# EasyEDA Pro project stm32_lin_router.eprj

# Schematic Schematic1
Board Name: Board1; Create Date: 2026-08-06; Page Name: P1; Project Name: stm32_lin_router; Schematic Name: Schematic1; Update Date: 2026-08-27; Company: EasyEDA.com; Page Size: A4; Version: V1.0
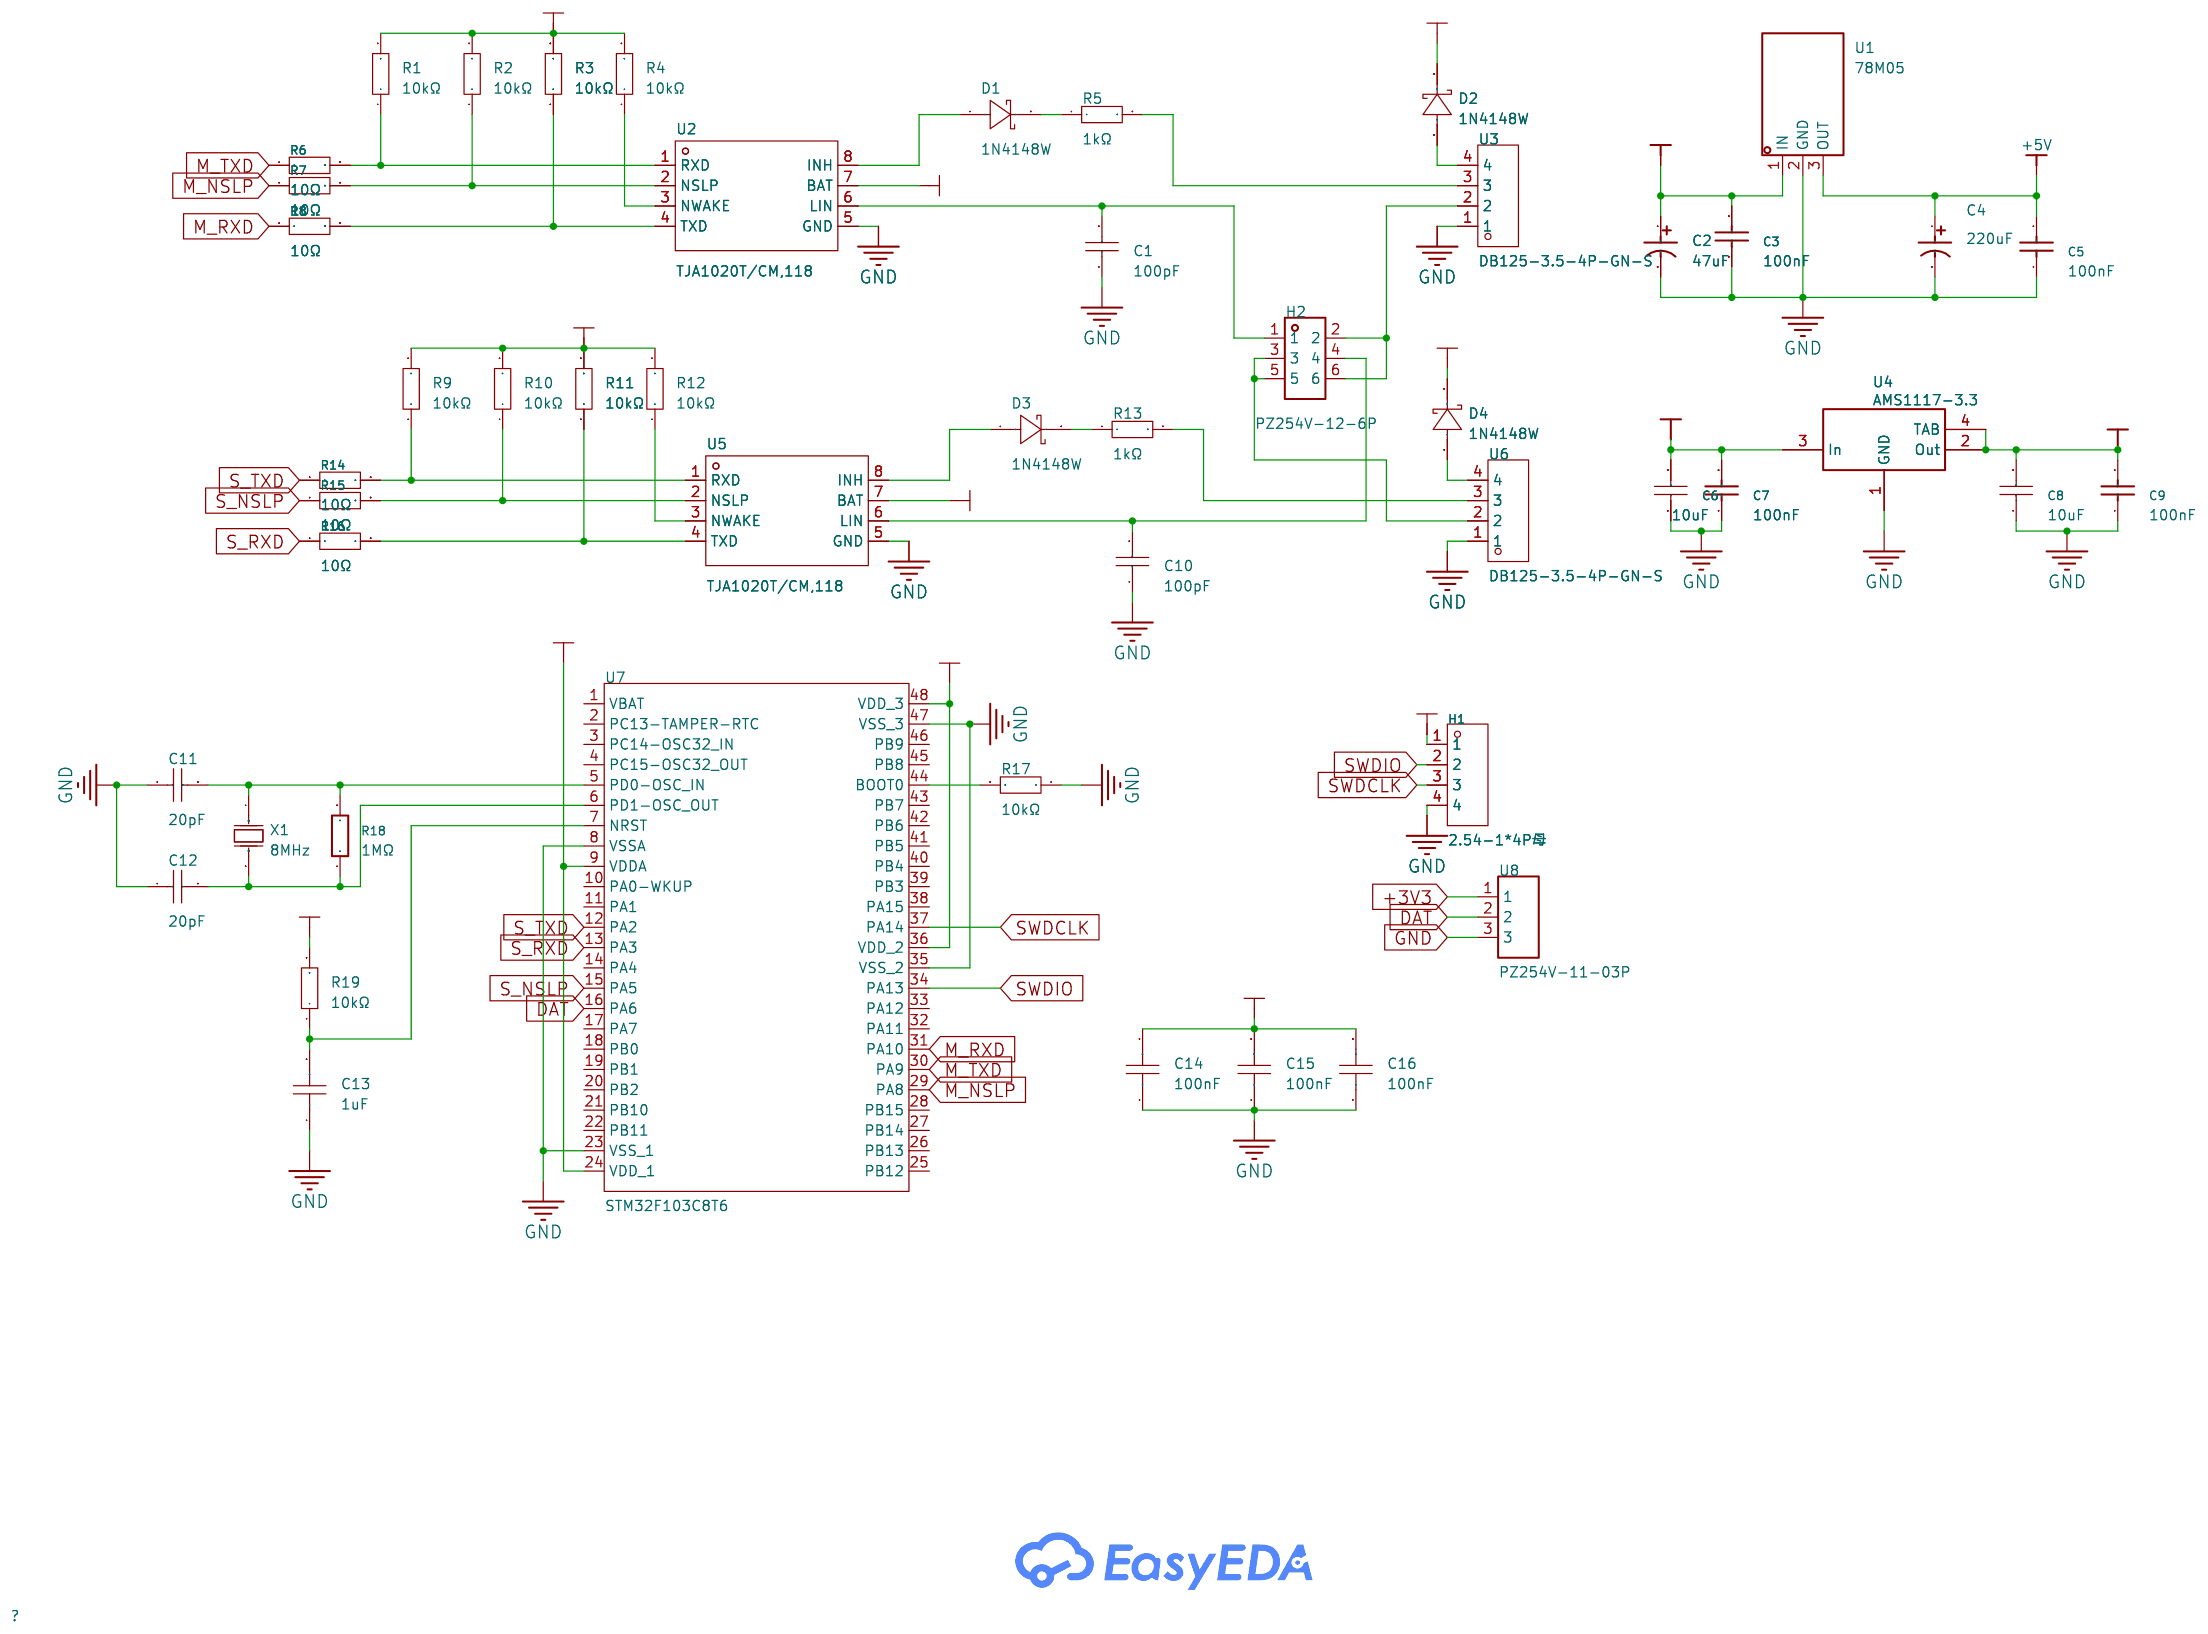
[diagram p0: schematic sheet]

## Parts
C1  100pF  [C0402]
C2  47uF  [CAP-SMD_BD6.3-L6.6-W6.6-FD]
C3  100nF  [C0402]
C4  220uF  [CAP-SMD_BD6.3-L6.6-W6.6-FD]
C5  100nF  [C0402]
C6  10uF  [C0603]
C7  100nF  [C0402]
C8  10uF  [C0603]
C9  100nF  [C0402]
C10  100pF  [C0402]
C11  20pF  [C0402]
C12  20pF  [C0402]
C13  1uF  [C0402]
C14  100nF  [C0402]
C15  100nF  [C0402]
C16  100nF  [C0402]
D1  1N4148W  [SOD-123_L2.7-W1.6-LS3.7-FD]
D2  1N4148W  [SOD-123_L2.7-W1.6-LS3.7-FD]
D3  1N4148W  [SOD-123_L2.7-W1.6-LS3.7-FD]
D4  1N4148W  [SOD-123_L2.7-W1.6-LS3.7-FD]
H1  2.54-1*4P母  [HDR-TH_4P-P2.54-V-F]
H2  PZ254V-12-6P  [HDR-TH_6P-P2.54-V-M-R2-C3-S2.54]
R1  10kΩ  [R0402]
R2  10kΩ  [R0402]
R3  10kΩ  [R0402]
R4  10kΩ  [R0402]
R5  1kΩ  [R0402]
R6  10Ω  [R0402]
R7  10Ω  [R0402]
R8  10Ω  [R0402]
R9  10kΩ  [R0402]
R10  10kΩ  [R0402]
R11  10kΩ  [R0402]
R12  10kΩ  [R0402]
R13  1kΩ  [R0402]
R14  10Ω  [R0402]
R15  10Ω  [R0402]
R16  10Ω  [R0402]
R17  10kΩ  [R0402]
R18  1MΩ  [R0402]
R19  10kΩ  [R0402]
U1  78M05  [TO-252-2_L6.6-W6.1-P4.57-LS9.9-BR-CW]
U2  TJA1020T/CM,118  [SOIC-8_L4.9-W3.9-P1.27-LS6.0-BL]
U3  DB125-3.5-4P-GN-S  [CONN-TH_DB125-3.5-4P-GN]
U4  AMS1117-3.3  [SOT-223-3_L6.5-W3.4-P2.30-LS7.0-BR]
U5  TJA1020T/CM,118  [SOIC-8_L4.9-W3.9-P1.27-LS6.0-BL]
U6  DB125-3.5-4P-GN-S  [CONN-TH_DB125-3.5-4P-GN]
U7  STM32F103C8T6  [LQFP-48_L7.0-W7.0-P0.50-LS9.0-BL]
U8  PZ254V-11-03P  [HDR-TH_3P-P2.54-V-M]
X1  8MHz  [CRYSTAL-SMD_L11.5-W4.8-LS12.7]

## Library data of the parts
C1 C10 = 0402CG101J500NT: LCSC Part Name: 100pF ±5% 50V; Supplier Part: C1546; Manufacturer: FH(风华); Supplier Footprint: 0402; JLCPCB Part Class: Basic Part; Datasheet: https://item.szlcsc.com/datasheet/0402CG101J500NT/1898.html; Supplier: LCSC; Tolerance: ±5%; Voltage Rating: 50V; Temperature Coefficient: C0G
C2 = RVT1V470M0605_C72522: Capacitance: Tolerance:±20% Tolerance:±20% Rated Voltage: Ripple Current:54mA@120Hz Equivalent Series Resistance(ESR):- φD: L: Lifetime @ Temp:2000hrs@105℃ Operating Temperature:-40℃~+105℃ Operating Temperature:-40℃~+105℃; LCSC Part Name: 47uF ±20% 35V; Supplier Part: C72522; Manufacturer: ROQANG(容强); Manufacturer Part: RVT1V470M0605; Supplier Footprint: SMD,D6.3xL5.4mm; JLCPCB Part Class: Extended Part; Datasheet: https://atta.szlcsc.com/upload/public/pdf/source/20170325/1490427950282.pdf; Supplier: LCSC; Tolerance: ±20%; Ripple Current: 54mA@120Hz; Lifetime @ Temp: 2000hrs@105℃; Operating Temperature: -40℃~+105℃
C3 C5 C7 C9 = CC0402KRX7R9BB104: Capacitance: Tolerance:±10% Tolerance:±10% Voltage Rated: Temperature Coefficient:; LCSC Part Name: 100nF ±10% 50V; Supplier Part: C131394; Manufacturer: YAGEO(国巨); Supplier Footprint: 0402; JLCPCB Part Class: Extended Part; Datasheet: https://atta.szlcsc.com/upload/public/pdf/source/20181008/C309510_22F155564471FAF6A489F7D68F34234E.pdf; Supplier: LCSC; Tolerance: ±10%
C4 = RVT1A221M0605_C72494: Capacitance: Tolerance:±20% Tolerance:±20% Rated Voltage: Ripple Current: Equivalent Series Resistance(ESR):- φD: L: Lifetime @ Temp:2000hrs@105℃ Operating Temperature:-40℃~+105℃ Operating Temperature:-40℃~+105℃; LCSC Part Name: 220uF ±20% 10V; Supplier Part: C72494; Manufacturer: ROQANG(容强); Manufacturer Part: RVT1A221M0605; Supplier Footprint: SMD,D6.3xL5.4mm; JLCPCB Part Class: Extended Part; Datasheet: https://atta.szlcsc.com/upload/public/pdf/source/20170325/1490427950282.pdf; Supplier: LCSC; Tolerance: ±20%; Lifetime @ Temp: 2000hrs@105℃; Operating Temperature: -40℃~+105℃
C6 C8 = CL10A106MO8NQNC: LCSC Part Name: 10uF ±20% 16V; Supplier Part: C92487; Manufacturer: SAMSUNG(三星); Supplier Footprint: 0603; JLCPCB Part Class: Extended Part; Datasheet: https://item.szlcsc.com/datasheet/CL10A106MO8NQNC/93680.html; Supplier: LCSC; Tolerance: ±20%; Voltage Rating: 16V; Temperature Coefficient: X5R
C11 C12 = 0402CG200J500NT: Capacitance:20pF Tolerance:±5% Tolerance:±5% Voltage Rating:50V Temperature Coefficient:C0G; LCSC Part Name: 20pF ±5% 50V; Supplier Part: C1554; Manufacturer: FH(风华); Supplier Footprint: 0402; JLCPCB Part Class: Basic Part; Datasheet: https://item.szlcsc.com/datasheet/0402CG200J500NT/1906.html; Supplier: LCSC; Tolerance: ±5%; Voltage Rating: 50V; Temperature Coefficient: C0G
C13 = CL05A105KA5NQNC: LCSC Part Name: 1uF ±10% 25V; Supplier Part: C52923; Manufacturer: SAMSUNG(三星); Supplier Footprint: 0402; JLCPCB Part Class: Basic Part; Datasheet: https://item.szlcsc.com/datasheet/CL05A105KA5NQNC/53938.html; Supplier: LCSC; Tolerance: ±10%; Voltage Rating: 25V; Temperature Coefficient: X5R
C14-C16 = CL05B104KO5NNNC: Capacitance:100nF Tolerance:±10% Tolerance:±10% Voltage Rating:16V Temperature Coefficient:X7R; LCSC Part Name: 100nF ±10% 16V; Supplier Part: C1525; Manufacturer: SAMSUNG(三星); Supplier Footprint: 0402; JLCPCB Part Class: Basic Part; Datasheet: https://item.szlcsc.com/datasheet/CL05B104KO5NNNC/1877.html; Supplier: LCSC; Tolerance: ±10%; Voltage Rating: 16V; Temperature Coefficient: X7R
D1-D4 = 1N4148W_C7420318: LCSC Part Name: 100V 150mA; Supplier Part: C7420318; Manufacturer: R+O(宏嘉诚); Supplier Footprint: SOD-123; JLCPCB Part Class: Extended Part; Datasheet: https://item.szlcsc.com/datasheet/1N4148W/8397140.html; Supplier: LCSC; Diode Configuration: Standalone; Pd - Power Dissipation: 400mW; Current - Rectified: 150mA; Voltage - DC Reverse(Vr): 100V; Voltage - Forward(Vf@If): 1.25V@150mA; Non-Repetitive Peak Forward Surge Current: 2A; Reverse Leakage Current (Ir): 1uA@75V; Reverse Recovery Time (trr): 4ns; Operating Junction Temperature Range: -55℃~+150℃
H1 = 2.54-1*4P母: LCSC Part Name: 间距:2.54mm 1x4P 直插; Supplier Part: C2718488; Manufacturer: BOOMELE(博穆精密); Supplier Footprint: 插件,P=2.54mm; JLCPCB Part Class: Extended Part; Datasheet: https://item.szlcsc.com/datasheet/2.54-1*4P%25E6%25AF%258D/2834502.html; Supplier: LCSC; Holes Structure: 1x4P; Pitch: 2.54mm; Circular Hole / Square Hole: Square Hole; Mounting Type: Through Hole; Number of Rows: 1; Number of Positions: 4P; Current Rating: 3A; Holes Direction: Top; Contact Material: Bronze; Operating Temperature: -40℃~+105℃
H2 = PZ254V-12-6P: Pin Structure:2x3P Pitch:2.54mm Row Spacing:2.54mm Circluar Pins/Square Pins:Square Pins Mounting Type:Straight Number of Rows:双排 Number of Pins:6P Current Rating (Max):- Voltage Rating (Max):- Length of Mating Pin:6mm Insulation Height:2.5mm Length of En; LCSC Part Name: 间距:2.54mm 2x3P 直插 方针; Supplier Part: C492420; Manufacturer: XFCN(兴飞); Supplier Footprint: 插件,P=2.54mm; JLCPCB Part Class: Extended Part; Datasheet: https://atta.szlcsc.com/upload/public/pdf/source/20200309/C492420_BAECB307B001054C09D200388220EAE6.pdf; Supplier: LCSC; Pin Structure: 2x3P; Pitch: 2.54mm; Row Spacing: 2.54mm; Circluar Pins/Square Pins: Square Pins; Mounting Type: Straight; Number of Rows: 双排; Number of Pins: 6P; Length of Mating Pin: 6mm; Insulation Height: 2.5mm; Length of End Connection Pin: 3mm; Operating Temperature Range: -40℃~+105℃; Color: Black
R1-R4 R9-R12 R17 R19 = 0402WGF1002TCE: LCSC Part Name: 10kΩ ±1% 62.5mW 厚膜电阻; Supplier Part: C25744; Manufacturer: UNI-ROYAL(厚声); Supplier Footprint: 0402; JLCPCB Part Class: Basic Part; Datasheet: https://item.szlcsc.com/datasheet/0402WGF1002TCE/26487.html; Supplier: LCSC; Type: Thick Film Resistor; Tolerance: ±1%; Power(Watts): 62.5mW; Voltage-Supply(Max): 50V; Temperature Coefficient: ±100ppm/℃; Operating Temperature: -55℃~+155℃
R5 R13 = 0402WGF1001TCE: LCSC Part Name: 1kΩ ±1% 62.5mW 厚膜电阻; Supplier Part: C11702; Manufacturer: UNI-ROYAL(厚声); Supplier Footprint: 0402; JLCPCB Part Class: Basic Part; Datasheet: https://item.szlcsc.com/datasheet/0402WGF1001TCE/12256.html; Supplier: LCSC; Type: Thick Film Resistor; Tolerance: ±1%; Power(Watts): 62.5mW; Voltage-Supply(Max): 50V; Temperature Coefficient: ±100ppm/℃; Operating Temperature: -55℃~+155℃
R6-R8 R14-R16 = 0402WGF100JTCE: LCSC Part Name: 10Ω ±1% 62.5mW 厚膜电阻; Supplier Part: C25077; Manufacturer: UNI-ROYAL(厚声); Supplier Footprint: 0402; JLCPCB Part Class: Basic Part; Datasheet: https://item.szlcsc.com/datasheet/0402WGF100JTCE/25820.html; Supplier: LCSC; Type: Thick Film Resistor; Tolerance: ±1%; Power(Watts): 62.5mW; Voltage-Supply(Max): 50V; Temperature Coefficient: ±200ppm/℃; Operating Temperature: -55℃~+155℃
R18 = 0402WGF1004TCE: Type:Thick Film Resistor Resistance:1MΩ Tolerance:±1% Tolerance:±1% Power(Watts):62.5mW Voltage-Supply(Max):50V Temperature Coefficient:±100ppm/℃ Temperature Coefficient:±100ppm/℃ Operating Temperature:-55℃~+155℃ Operating Temperature:-55℃~+155℃; LCSC Part Name: 1MΩ ±1% 62.5mW 厚膜电阻; Supplier Part: C26083; Manufacturer: UNI-ROYAL(厚声); Supplier Footprint: 0402; JLCPCB Part Class: Basic Part; Datasheet: https://item.szlcsc.com/datasheet/0402WGF1004TCE/26826.html; Supplier: LCSC; Type: Thick Film Resistor; Tolerance: ±1%; Power(Watts): 62.5mW; Voltage-Supply(Max): 50V; Temperature Coefficient: ±100ppm/℃; Operating Temperature: -55℃~+155℃
U1 = 78M05_C347278: Output Type:Fixed Maximum Input Voltage:35V Output Voltage:5V Output Voltage:5V Output Current:1A Power Supply Rejection Ratio (PSRR):80dB@(120Hz) Dropout Voltage:2V@(500mA) standby current:6mA Feature:Short-Circuit  Protection；Thermal Protection(TSD) Ope; LCSC Part Name: 输入35V 输出5V; Supplier Part: C347278; Manufacturer: UMW(友台半导体); Supplier Footprint: TO-252-2; JLCPCB Part Class: Extended Part; Datasheet: https://atta.szlcsc.com/upload/public/pdf/source/20240827/0E07D62EB5B1694607256ADF81712489.pdf; Supplier: LCSC; Output Type: Fixed; Maximum Input Voltage: 35V; Output Voltage: 5V; Output Current: 1A; Power Supply Rejection Ratio (PSRR): 80dB@(120Hz); Dropout Voltage: 2V@(500mA); standby current: 6mA; Feature: Short-Circuit  Protection；Thermal Protection(TSD); Operating Temperature: -20℃~+85℃; Output Polarity: Positive electrode; Number of Outputs: 1
U2 U5 = TJA1020T/CM,118: LCSC Part Name: LIN收发器; Supplier Part: C6950; Manufacturer: NXP(恩智浦); Supplier Footprint: SOIC-8; JLCPCB Part Class: Extended Part; Datasheet: https://www.nxp.com/docs/en/data-sheet/TJA1020.pdf; Supplier: LCSC; Type: Transceiver; Number of Drivers: 1; Number of Receivers: 1; Voltage - Supply: 5V~27V; Current - Supply: 8mA; Quiescent Supply Current: 3uA; ESD Protect: ±4kV; Features: Bus fault protection；Local wake-up；Slope control；TXD timeout protection；Bus wake-up；Low-power mode；Thermal shutdown protection
U3 U6 = DB125-3.5-4P-GN-S: LCSC Part Name: 1x4P 3.5mm 直插 排数:1 每排P数:4; Supplier Part: C2757925; Manufacturer: DORABO(地博电气); Supplier Footprint: 插件,P=3.5mm; JLCPCB Part Class: Extended Part; Datasheet: https://item.szlcsc.com/datasheet/DB125-3.5-4P-GN-S/2874766.html; Supplier: LCSC; Number of Positions or Pins: 1x4P; Pitch: 3.5mm; Color: Green; Mounting Type: Through Hole; Number of Pins: 4P; Number of Rows: 1; Number of PINs Per Row: 4; Screw Specification: M2; Current Rating: 10A; Voltage Rating (Max): 300V; Wire Gauge - AWG: 16~28; Wire Gauge - mm2: 1; Operating Temperature: -40℃~+105℃; Height Above Board: 8.6mm
U4 = AMS1117-3.3: Supplier Part: C6186; Supplier: LCSC; Manufacturer: AMS; image: //image.lceda.cn/szlcsc/C6186.jpg; sourceId: dwIGgezVh; timeStamp: 1476261164; LCSC Assembly: Yes; spicePre: U
U7 = STM32F103C8T6: LCSC Part Name: 主流增强型ARM Cortex-M3 MCU，具有64 KB Flash、72 MHz CPU、电机控制、USB和CAN; Supplier Part: C8734; Manufacturer: ST(意法半导体); Supplier Footprint: LQFP-48(7x7); JLCPCB Part Class: Extended Part; Datasheet: https://item.szlcsc.com/datasheet/STM32F103C8T6/9243.html; Supplier: LCSC; CPU Core: ARM Cortex-M3; CPU Maximum Speed: 72MHz; Core Size: 32 Bit; Program Storage Size: 64KB; Program Memory Type: FLASH; RAM Size: 20KB; Number of I/O: 37; ADC (Bit): 12bit; Oscillator Type: Built-in; Voltage - Supply: 2V~3.6V; Operating Temperature: -40℃~+85℃
U8 = PZ254V-11-03P: Pin Structure:1x3P Pitch:2.54mm Row Spacing:- Circluar Pins/Square Pins:Policy Mounting Type:Straight Number of Rows:Single Row Number of Pins:3P Current Rating:3A Voltage Rating (Max):250V Length of Mating Pin:6mm Insulation Height:2.5mm Length of End Co; LCSC Part Name: 1x3P 间距:2.54mm 方针 直插; Supplier Part: C2937625; Manufacturer: XFCN(兴飞); Supplier Footprint: 插件,P=2.54mm; JLCPCB Part Class: Extended Part; Datasheet: https://atta.szlcsc.com/upload/public/pdf/source/20200309/C492402_8335C3D49C4E4C618838D59BB1D024C1.pdf; Supplier: LCSC; Pin Structure: 1x3P; Pitch: 2.54mm; Circluar Pins/Square Pins: Policy; Mounting Type: Straight; Number of Rows: Single Row; Number of Pins: 3P; Current Rating: 3A; Voltage Rating (Max): 250V; Length of Mating Pin: 6mm; Insulation Height: 2.5mm; Length of End Connection Pin: 3mm; Operating Temperature: -40℃~+105℃; Color: Black
X1 = X49SM8MSD2SC: Type:Crystal Oscillator Frequency:8MHz Normal temperature Frequency Tolerance:±20ppm Normal temperature Frequency Tolerance:±20ppm Load Capacitance:20pF Frequency Stability:±30ppm Frequency Stability:±30ppm Operating Temperature:-20℃~+70℃ Operating Temper; LCSC Part Name: HC-49SMD 8MHZ 20PF ±20PPM -20~70℃（±30PPM）; Supplier Part: C12674; Manufacturer: YXC(扬兴晶振); Supplier Footprint: HC-49S-SMD; JLCPCB Part Class: Basic Part; Datasheet: https://item.szlcsc.com/datasheet/X49SM8MSD2SC/13310.html; Supplier: LCSC; Type: Crystal Oscillator; Normal temperature Frequency Tolerance: ±20ppm; Load Capacitance: 20pF; Frequency Stability: ±30ppm; Operating Temperature: -20℃~+70℃

## Nets
+3V3: C8.2 C9.2 C14.2 C15.2 C16.2 H1.1 R1.2 R2.2 R3.2 R4.2 R9.2 R10.2 R11.2 R12.2 R19.2 U4.2(Out) U4.4(TAB) U7.9(VDDA) U7.24(VDD_1) U7.36(VDD_2) U7.48(VDD_3) U8.1
+5V: C4.1 C5.2 C6.2 C7.2 U1.3(OUT) U4.3(In)
+12V: C2.1 C3.2 D2.2(K) U1.1(IN) U2.7(BAT)
+12V_S: D4.2(K) U5.7(BAT)
GND: C1.1 C2.2 C3.1 C4.2 C5.1 C6.1 C7.1 C8.1 C9.1 C10.1 C11.1 C12.1 C13.1 C14.1 C15.1 C16.1 H1.4 R17.1 U1.2(GND) U2.5(GND) U3.1 U4.1(GND) U5.5(GND) U6.1 U7.8(VSSA) U7.23(VSS_1) U7.35(VSS_2) U7.47(VSS_3) U8.3
DAT: U7.16(PA6) U8.2
M_NSLP: R7.1 U7.29(PA8)
M_RXD: R8.1 U7.31(PA10)
M_TXD: R6.1 U7.30(PA9)
S_NSLP: R15.1 U7.15(PA5)
S_RXD: R16.1 U7.13(PA3)
S_TXD: R14.1 U7.12(PA2)
SWDCLK: H1.3 U7.37(PA14)
SWDIO: H1.2 U7.34(PA13)
$1N1166: R4.1 U2.3(NWAKE)
$1N1222: R1.1 R6.2 U2.1(RXD)
$1N1227: R3.1 R8.2 U2.4(TXD)
$1N1230: R2.1 R7.2 U2.2(NSLP)
$1N1781: D1.1(A) U2.8(INH)
$1N1787: D1.2(K) R5.1
$1N2135: D2.1(A) U3.4
$1N2141: R5.2 U3.3
$1N2164: C1.2 H2.1 U2.6(LIN)
$1N3687: R11.1 R16.2 U5.4(TXD)
$1N3688: R12.1 U5.3(NWAKE)
$1N3690: R9.1 R14.2 U5.1(RXD)
$1N3691: R10.1 R15.2 U5.2(NSLP)
$1N3697: D3.1(A) U5.8(INH)
$1N3699: R13.2 U6.3
$1N3700: D4.1(A) U6.4
$1N3701: D3.2(K) R13.1
$1N5497: R17.2 U7.44(BOOT0)
$1N5531: C11.2 R18.2 U7.5(PD0-OSC_IN) X1.1(OSC1)
$1N5532: C12.2 R18.1 U7.6(PD1-OSC_OUT) X1.2(OSC2)
$1N5663: C13.2 R19.1 U7.7(NRST)
$1N6885: H2.2 H2.6 U3.2
$1N6918: H2.3 H2.5 U6.2
$1N6930: C10.2 H2.4 U5.6(LIN)

Not connected (* = marked no-connect by the designer): U7 1(VBAT) 2(PC13-TAMPER-RTC) 3(PC14-OSC32_IN) 4(PC15-OSC32_OUT) 10(PA0-WKUP) 11(PA1) 14(PA4) 17(PA7) 18(PB0) 19(PB1) 20(PB2) 21(PB10) 22(PB11) 25(PB12) 26(PB13) 27(PB14) 28(PB15) 32(PA11) 33(PA12) 38(PA15) 39(PB3) 40(PB4) 41(PB5) 42(PB6) 43(PB7) 45(PB8) 46(PB9)

# Board PCB1
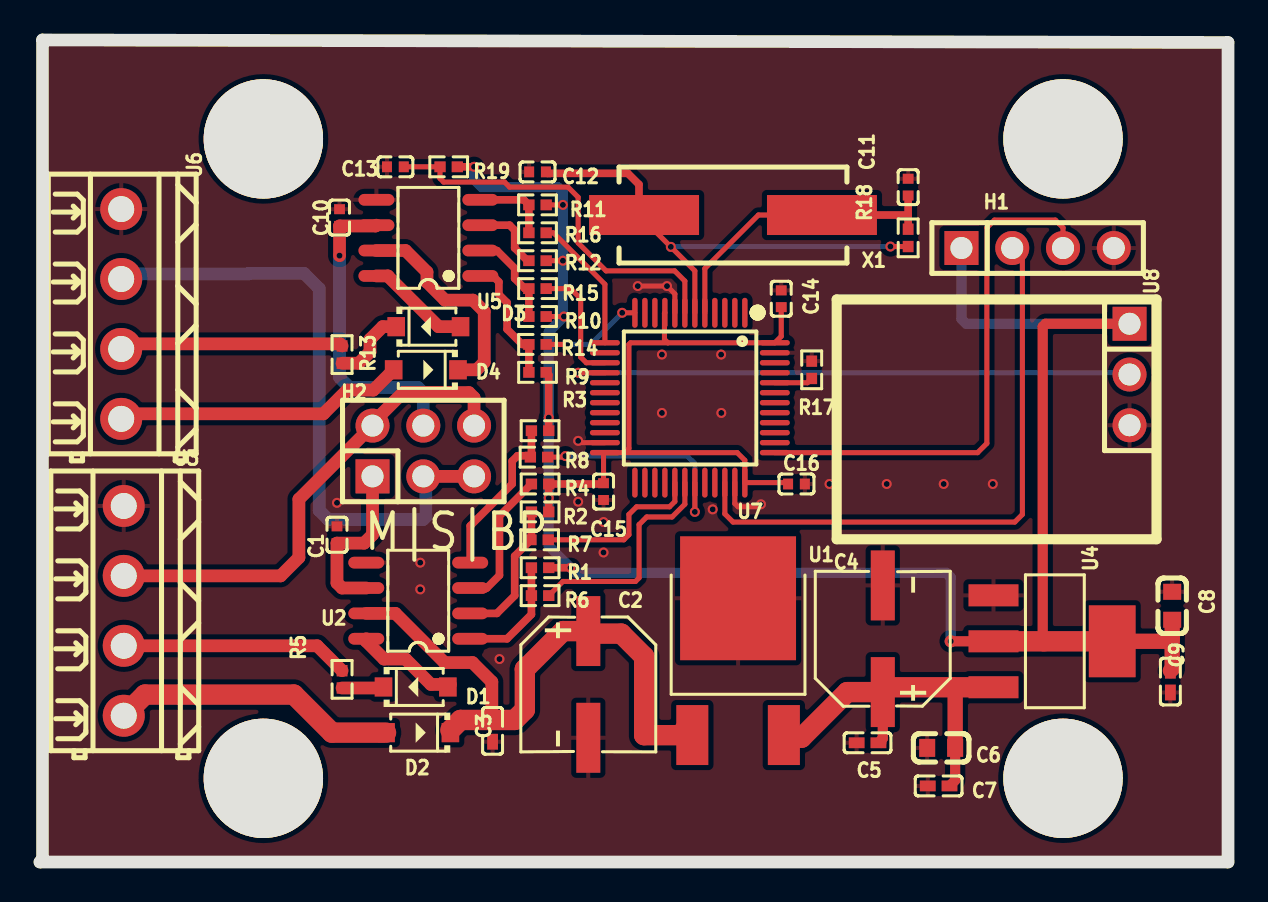
[diagram p1: board, top side]
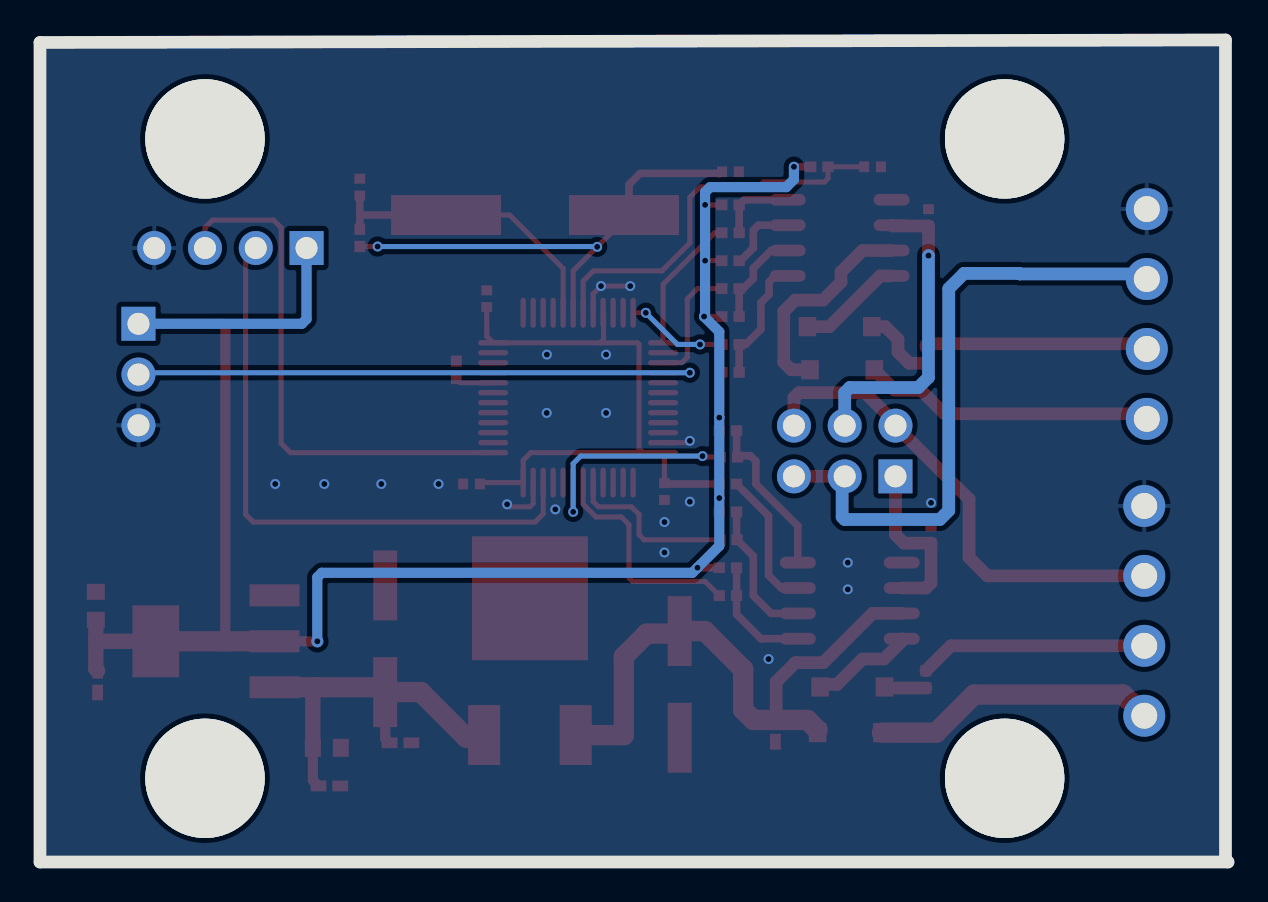
[diagram p2: board, bottom side, seen from below]

Outline 59.44 x 41.15 mm; copper layers: Top Layer, Bottom Layer. Coordinates in mm from the lower left corner of the outline.
Outline path: 0,0 59.44,0 59.44,41.02 0.13,41.15 0.13,0.13 0,0
Stack: Top Layer 0.035mm / Dielectric1 1.51mm FR4 er 4.5 / Bottom Layer 0.035mm

## Design rules (mm)
template: Custom Config
spacing copperThickness1oz (default): track to track 0.102, other pairs 0.152 to 0.3
spacing copperThickness2oz: track to track 0.203, other pairs 0.152 to 0.3
track width copperThickness1oz (default): min 0.127, default 0.254, max 2.54
track width copperThickness2oz: min 0.203, default 0.254, max 2.54
differential pair differentialPair (default): width min 0.127, default 0.254, max 2.54; gap min 0.152, default 0.152
via viaSize (default): diameter min 0.5, default 0.5, max 10; hole min 0.3, default 0.3, max 6.3

## Placement (name value [footprint] x y rotation side)
C1  100pF  [C0402]  14.86 16.38 270 top
C2  47uF  [CAP-SMD_BD6.3-L6.6-W6.6-FD]  27.43 8.89 270 top
C3  100nF  [C0402#2]  22.64 6.57 90 top
C4  220uF  [CAP-SMD_BD6.3-L6.6-W6.6-FD]  42.16 11.18 90 top
C5  100nF  [C0402#2]  41.4 5.97 0 top
C6  10uF  [C0603]  45.09 5.72 0 top
C7  100nF  [C0402#2]  44.96 3.81 0 top
C8  10uF  [C0603]  56.64 12.83 270 top
C9  100nF  [C0402#2]  56.55 9.03 90 top
C10  100pF  [C0402]  14.99 32.26 270 top
C11  20pF  [C0402]  43.43 33.78 270 top
C12  20pF  [C0402]  24.89 34.54 0 top
C13  1uF  [C0402]  17.78 34.8 0 top
C14  100nF  [C0402]  37.08 28.19 270 top
C15  100nF  [C0402]  28.19 18.54 90 top
C16  100nF  [C0402]  37.85 18.92 180 top
D1  1N4148W  [SOD-123_L2.7-W1.6-LS3.7-FD]  18.8 8.76 180 top
D2  1N4148W  [SOD-123_L2.7-W1.6-LS3.7-FD]  18.92 6.48 0 top
D3  1N4148W  [SOD-123_L2.7-W1.6-LS3.7-FD]  19.43 26.8 180 top
D4  1N4148W  [SOD-123_L2.7-W1.6-LS3.7-FD]  19.3 24.64 0 top
H1  2.54-1*4P母  [HDR-TH_4P-P2.54-V-F]  49.91 30.73 0 top
H2  PZ254V-12-6P  [HDR-TH_6P-P2.54-V-M-R2-C3-S2.54]  19.18 20.57 0 top
NOREF  -  [Pad_e100]  11.18 4.19 0 top
NOREF#2  -  [Pad_e97]  51.18 36.2 0 top
NOREF#3  -  [Pad_e92]  11.18 36.2 0 top
NOREF#4  -  [Pad_e101]  51.18 4.19 0 top
R1  10kΩ  [R0402]  25.02 14.73 0 top
R2  10kΩ  [R0402]  25.02 17.53 0 top
R3  10kΩ  [R0402]  25.02 21.59 0 top
R4  10kΩ  [R0402]  25.02 18.92 0 top
R5  1kΩ  [R0402]  15.11 9.14 90 top
R6  10Ω  [R0402]  25.02 13.34 180 top
R7  10Ω  [R0402]  25 16.13 180 top
R8  10Ω  [R0402]  24.97 20.27 180 top
R9  10kΩ  [R0402]  24.89 24.51 0 top
R10  10kΩ  [R0402]  24.89 27.31 0 top
R11  10kΩ  [R0402]  24.89 32.89 0 top
R12  10kΩ  [R0402]  24.89 30.1 0 top
R13  1kΩ  [R0402]  15.11 25.4 90 top
R14  10Ω  [R0402]  24.89 25.91 180 top
R15  10Ω  [R0402]  24.89 28.7 180 top
R16  10Ω  [R0402]  24.89 31.5 180 top
R17  10kΩ  [R0402]  38.61 24.64 270 top
R18  1MΩ  [R0402]  43.43 31.24 90 top
R19  10kΩ  [R0402]  20.45 34.8 0 top
U1  78M05  [TO-252-2_L6.6-W6.1-P4.57-LS9.9-BR-CW]  34.93 9.78 270 top
U2  TJA1020T/CM,118  [SOIC-8_L4.9-W3.9-P1.27-LS6.0-BL]  18.92 13.08 90 top
U3  DB125-3.5-4P-GN-S  [CONN-TH_DB125-3.5-4P-GN]  4.19 12.57 270 top
U4  AMS1117-3.3  [SOT-223-3_L6.5-W3.4-P2.30-LS7.0-BR]  50.67 11.05 180 top
U5  TJA1020T/CM,118  [SOIC-8_L4.9-W3.9-P1.27-LS6.0-BL]  19.43 31.24 90 top
U6  DB125-3.5-4P-GN-S  [CONN-TH_DB125-3.5-4P-GN]  4.06 27.43 270 top
U7  STM32F103C8T6  [LQFP-48_L7.0-W7.0-P0.50-LS9.0-BL]  32.51 23.24 180 top
U8  PZ254V-11-03P  [HDR-TH_3P-P2.54-V-M]  54.51 24.4 270 top
X1  8MHz  [CRYSTAL-SMD_L11.5-W4.8-LS12.7]  34.67 32.39 180 top

## Footprints (pads in the part's own frame, mm; a bottom-side part is the same pattern mirrored in y, then rotated)
C0402
  rect 0.5x0.54 smd: 1(-0.42,0) 2(0.42,0)
C0402#2
  rect 0.79x0.54 smd: 1(-0.545,0) 2(0.545,0)
C0603
  rect 0.8x0.9 smd: 1(-0.7,0) 2(0.7,0)
CAP-SMD_BD6.3-L6.6-W6.6-FD
  rect 3.5x1.2 smd: 1(-2.67,0) 2(2.67,0)
CONN-TH_DB125-3.5-4P-GN
  round 2.1 hole 1.3: 1(-5.25,0) 2(-1.75,0) 3(1.75,0) 4(5.25,0)
CRYSTAL-SMD_L11.5-W4.8-LS12.7
  rect 5.5x2 smd: 1(-4.45,0) 2(4.45,0)
HDR-TH_3P-P2.54-V-M
  rect 1.7x1.7 hole 1.1: 1(-2.54,0)
  round 1.7 hole 1.1: 2(0,0) 3(2.54,0)
HDR-TH_4P-P2.54-V-F
  rect 1.7x1.7 hole 1.1: 1(-3.81,0)
  round 1.7 hole 1.1: 2(-1.27,0) 3(1.27,0) 4(3.81,0)
HDR-TH_6P-P2.54-V-M-R2-C3-S2.54
  rect 1.7x1.7 hole 1.1: 1(-2.54,-1.27)
  round 1.7 hole 1.1: 2(-2.54,1.27) 3(0,-1.27) 4(0,1.27) 5(2.54,-1.27) 6(2.54,1.27)
LQFP-48_L7.0-W7.0-P0.50-LS9.0-BL
  oval 0.27x1.5 smd: 1(-2.75,-4.25) 2(-2.25,-4.25) 3(-1.75,-4.25) 4(-1.25,-4.25) 5(-0.75,-4.25) 6(-0.25,-4.25) 7(0.25,-4.25) 8(0.75,-4.25) 9(1.25,-4.25) 10(1.75,-4.25) 11(2.25,-4.25) 12(2.75,-4.25) 25(2.75,4.25) 26(2.25,4.25) 27(1.75,4.25) 28(1.25,4.25) 29(0.75,4.25) 30(0.25,4.25) 31(-0.25,4.25) 32(-0.75,4.25) 33(-1.25,4.25) 34(-1.75,4.25) 35(-2.25,4.25) 36(-2.75,4.25)
  oval 1.5x0.27 smd: 13(4.25,-2.75) 14(4.25,-2.25) 15(4.25,-1.75) 16(4.25,-1.25) 17(4.25,-0.75) 18(4.25,-0.25) 19(4.25,0.25) 20(4.25,0.75) 21(4.25,1.25) 22(4.25,1.75) 23(4.25,2.25) 24(4.25,2.75) 37(-4.25,2.75) 38(-4.25,2.25) 39(-4.25,1.75) 40(-4.25,1.25) 41(-4.25,0.75) 42(-4.25,0.25) 43(-4.25,-0.25) 44(-4.25,-0.75) 45(-4.25,-1.25) 46(-4.25,-1.75) 47(-4.25,-2.25) 48(-4.25,-2.75)
Pad_e92
  round 5.969 hole 5.969: 1(0,0)
Pad_e97
  round 5.969 hole 5.969: 1(0,0)
Pad_e100
  round 5.969 hole 5.969: 1(0,0)
Pad_e101
  round 5.969 hole 5.969: 1(0,0)
R0402
  rect 0.566x0.54 smd: 1(-0.433,0) 2(0.433,0)
SOD-123_L2.7-W1.6-LS3.7-FD
  rect 0.88x0.96 smd: 1(-1.61,0) 2(1.61,0)
SOIC-8_L4.9-W3.9-P1.27-LS6.0-BL
  oval 0.588x1.8 smd: 1(-1.905,-2.6) 2(-0.635,-2.6) 3(0.635,-2.6) 4(1.905,-2.6) 5(1.905,2.6) 6(0.635,2.6) 7(-0.635,2.6) 8(-1.905,2.6)
SOT-223-3_L6.5-W3.4-P2.30-LS7.0-BR
  rect 2.5x1.1 smd: 1(2.97,-2.3) 2(2.97,0) 3(2.97,2.3)
  rect 2.34x3.6 smd: 4(-2.97,0)
TO-252-2_L6.6-W6.1-P4.57-LS9.9-BR-CW
  rect 3x1.6 smd: 1(3.424,-2.29) 3(3.424,2.29)
  rect 6.2x5.8 smd: 2(-3.424,0)

## Nets
As in the schematic.

Pads without a net: NOREF 1; NOREF#2 1; NOREF#3 1; NOREF#4 1; U7 1 2 3 4 10 11 14 17 18 19 20 21 22 25 26 27 28 32 33 38 39 40 41 42 43 45 46

## Via types
v1: diameter 0.5, hole 0.3, Top Layer to Bottom Layer, 34 vias
v2: diameter 0.61, hole 0.305, Top Layer to Bottom Layer, 2 vias

## Routing (per net, layer and track width the routed paths; a pad name or vN(x,y) marks a point on that pad's centre or on a via; arc(x,y) is an arc through that point)
+3V3: length 133.3
  Top Layer w0.254: 29.25,20.49 U7.24 28.19,20.42 C15.2 ; 29.25,20.49 34.88,20.49 35.26,20.11 U7.36 37.36,18.99 C16.2 ; 29.25,20.49 29.46,20.7 29.46,25.91 29.55,25.99 31.41,25.99 ; 31.41,25.99 31.24,26.16 31.24,27.47 U7.9 ; 31.41,25.99 U7.48 37.08,26.31 C14.2 ; R11.2 v1(26.16,32.89) ; R10.2 v1(26.21,27.31) ; R12.2 v1(26.16,30.1)
  Top Layer w0.381: C15.2 28.16,18.92 R4.2 v1(25.45,18.22) R2.2 ; v1(26.54,14.73) R1.2 ; v1(21.72,34.8) R19.2 ; R9.2 25.45,24.38 v1(25.45,22.24) R3.2
  Top Layer w0.508: U8.1 50.31,26.94 50.16,26.8 50.16,11.1 50.22,11.05 ; U4.2 v2(45.56,11.05)
  Top Layer w0.762: C9.2 56.64,9.67 56.64,11.14 ; U4.4 56.55,11.05 56.64,11.14 ; 56.64,11.14 C8.2
  Top Layer w1.016: U4.4 U4.2
  Bottom Layer w0.508: v2(45.56,11.05) 45.56,14.26 45.34,14.48 26.8,14.48 v1(26.54,14.73) 25.45,15.82 v1(25.45,18.22) v1(25.45,22.24) 25.45,26.54 v1(26.21,27.31) 26.16,27.36 v1(26.16,30.1) v1(26.16,32.89) 26.16,33.53 25.91,33.78 22.1,33.78 21.72,34.16 v1(21.72,34.8) ; U8.1 46.34,26.94 46.1,27.18 H1.1
+5V: length 20
  Top Layer w0.508: 42.09,5.96 42.09,6.11 42.16,6.19 C4.1 ; C7.2 45.78,4.09 C6.2
  Top Layer w0.762: 45.64,8.75 45.78,8.6 C6.2
  Top Layer w1.016: U4.3 42.41,8.75 C4.1 40.38,8.51 38.1,6.22 37.22,6.22 37.22,6.99
+12V: length 29.7
  Top Layer w0.635: C3.2 22.61,7.15 22.61,9.02 21.64,9.98 20.24,9.98 17.78,12.45 U2.7
  Top Layer w1.016: 20.53,6.6 21.04,7.11 C3.2 23.75,7.11 24.26,7.62 24.26,9.65 26.16,11.56 C2.1 27.56,11.43 29.08,11.43 30.23,10.29 30.23,6.35 32,6.35 32.63,6.99
+12V_S: length 11
  Top Layer w0.635: U5.7 18.29,30.61 19.36,29.53 19.36,29.03 20.26,28.13 21.66,28.13 22.22,27.56 22.22,25.02 21.85,24.64 D4.2
GND: length 6.8
  Top Layer w0.254: U7.23 27.02,20.99 v1(26.92,21.08) ; v1(29.91,28.83) v1(31.37,28.83) 31.76,28.44 U7.8 ; v1(36.07,17.91) 35.94,17.78 34.93,17.78 34.76,17.94 U7.35
  vias: v1(14.86,17.98) v1(19.02,14.99) v1(19.02,13.65) v1(22.99,10.16) v1(26.92,18.03) v1(28.19,17.02) v1(28.19,15.49) v1(31.12,25.4) v1(31.12,22.48) v1(33.66,17.65) v1(34.08,25.4) v1(34.09,22.48) v1(39.5,18.92) v1(42.36,18.92) v1(45.21,18.92) v1(47.67,18.92)
DAT: length 29
  Top Layer w0.254: U7.16 v1(26.92,24.49)
  Bottom Layer w0.254: v1(26.92,24.49) 54.42,24.49 U8.2
M_NSLP: length 8.7
  Top Layer w0.254: R7.1 29.21,16.13 29.46,16.38 29.46,17.4 29.84,17.78 31.5,17.78 31.76,18.05 U7.29
M_RXD: length 11.4
  Top Layer w0.254: U7.31 v1(32.76,17.53) ; v1(26.29,20.32) 26.24,20.27 R8.1
  Bottom Layer w0.254: v1(32.76,17.53) 32.76,19.94 32.38,20.32 v1(26.29,20.32)
M_TXD: length 11.3
  Top Layer w0.254: U7.30 32.26,17.91 31.62,17.27 30.35,17.27 29.97,16.89 29.97,14.22 29.79,14.04 26.16,14.04 R6.1
S_NSLP: length 6.2
  Top Layer w0.254: R15.1 26.54,28.7 27.05,28.19 27.05,25.27 27.33,24.99 U7.15
S_RXD: length 6.9
  Top Layer w0.254: U7.13 28.26,28.92 25.68,31.5 R16.1
S_TXD: length 5.1
  Top Layer w0.254: R14.1 v1(26.42,25.91) ; v1(29.13,27.49) U7.12
  Bottom Layer w0.254: v1(26.42,25.91) 27.54,25.91 v1(29.13,27.49)
SWDCLK: length 26.7
  Top Layer w0.254: U7.37 46.91,20.49 47.37,20.96 47.37,31.75 47.75,32.13 50.8,32.13 51.18,31.75 H1.3
SWDIO: length 30.3
  Top Layer w0.254: H1.2 49.15,30.23 49.15,17.4 48.77,17.02 34.67,17.02 34.26,17.43 U7.34
$1N1166: length 7
  Top Layer w0.381: 22.22,13.72 22.35,13.72 22.99,14.35 22.99,17.32 R4.1
  Top Layer w0.508: U2.3 22.22,13.72
$1N1222: length 5.9
  Top Layer w0.381: R1.1 R6.2 24.59,12.39 23.37,11.18 U2.1
$1N1227: length 8.3
  Top Layer w0.381: R3.1 24.59,20.32 R8.2 24.47,20.34 23.89,20.34 23.62,20.07 23.62,18.92 21.52,16.82 U2.4
$1N1230: length 7.1
  Top Layer w0.381: R2.1 24.59,16.15 R7.2 23.75,15.32 23.75,13.34 22.86,12.45 U2.2
$1N1781: length 5.2
  Top Layer w0.635: U2.8 16.32,11.05 17.21,10.16 18.29,10.16 19.56,8.89 20.53,8.89
$1N1787: length 2.1
  Top Layer w0.635: 17.19,8.76 17.13,8.71 R5.1
$1N2135: length 14.3
  Top Layer w1.016: U3.4 5.25,8.38 12.7,8.38 14.6,6.48 D2.1
$1N2141: length 11.4
  Top Layer w0.635: R5.2 13.87,10.82 U3.3
$1N2164: length 8.4
  Top Layer w0.635: H2.1 16.64,16.38 16.22,15.96 C1.2 14.86,13.97 15.11,13.72 U2.6
$1N3687: length 3.9
  Top Layer w0.381: R16.2 R11.1 24.21,33.15 U5.4
$1N3688: length 3.7
  Top Layer w0.381: U5.3 23.5,31.88 23.75,31.62 23.75,30.73 24.38,30.1 R12.1
$1N3690: length 6.4
  Top Layer w0.381: U5.1 22.05,29.32 22.68,29.32 22.96,29.04 22.96,28.41 23.37,28 23.37,26.67 24.13,25.91 R14.2 R9.1
$1N3691: length 4.9
  Top Layer w0.381: R10.1 R15.2 24.26,28.7 23.75,29.21 23.75,29.72 22.86,30.61 U5.2
$1N3697: length 5.3
  Top Layer w0.635: D3.1 19.94,26.8 17.4,29.34 U5.8
$1N3699: length 11.2
  Top Layer w0.635: U6.3 4.32,25.94 15.01,25.94 R13.2
$1N3700: length 14.6
  Top Layer w0.635: U6.4 4.32,22.44 14.18,22.44 15.37,23.62 16.68,23.62 17.69,24.64
$1N3701: length 3.8
  Top Layer w0.635: R13.1 15.95,24.97 16.51,25.53 16.51,26.16 17.15,26.8 D3.2
$1N5497: length 1.9
  Top Layer w0.254: U7.44 38.39,23.99 R17.2
$1N5531: length 15.2
  Top Layer w0.254: 38.87,32.39 35.94,32.39 33.26,29.71 U7.5
  Top Layer w0.381: 38.87,32.39 43.43,32.39 ; 43.43,32.39 C11.2 ; 43.43,32.39 R18.2
$1N5532: length 24.4
  Top Layer w0.254: U7.6 32.76,29.59 v1(31.56,30.79) 29.97,32.39 ; R18.1 v1(42.55,30.81)
  Top Layer w0.381: C12.2 25.38,34.47 29.41,34.47 29.97,33.91 29.97,32.39
  Bottom Layer w0.254: v1(31.56,30.79) 31.58,30.81 v1(42.55,30.81)
$1N5663: length 19.7
  Top Layer w0.254: 20.01,34.8 20.01,34.22 20.19,34.04 23.24,34.04 23.5,33.78 26.42,33.78 26.92,33.27 26.92,30.99 28.32,29.59 31.75,29.59 32.26,29.08 U7.7 ; C13.2 R19.1
$1N6885: length 24.6
  Top Layer w0.635: U3.2 12.04,14.32 12.95,15.24 12.95,18.16 H2.2 16.64,21.97 18.16,23.5 21.46,23.5 21.72,23.24 H2.6
$1N6918: length 31.6
  Top Layer w0.635: H2.3 H2.5
  Bottom Layer w0.635: U6.2 4.32,29.44 10.41,29.44 10.44,29.46 13.21,29.46 13.97,28.7 13.97,17.59 14.42,17.15 19.18,17.15 19.3,17.27 19.3,19.18 H2.3
$1N6930: length 15.6
  Top Layer w0.635: v2(14.99,30.35) C10.2 16.79,31.84 U5.6
  Bottom Layer w0.635: H2.4 19.18,23.5 18.92,23.75 15.49,23.75 14.99,24.26 v2(14.99,30.35)

## Copper pours and planes (outline as drawn; the poured copper is in the pictures)
GND on Top Layer: -7.62,50.55 66.55,50.55 66.55,-7.37 -7.62,-7.37
GND on Bottom Layer: -6.22,49.02 66.17,49.02 66.17,-5.08 -6.22,-5.08

## Text on the board
Top Silkscreen Layer: M|S|BP
